# EAGLE design SparkFun GPS NEO_M9N (EAGLE 9.4.2)
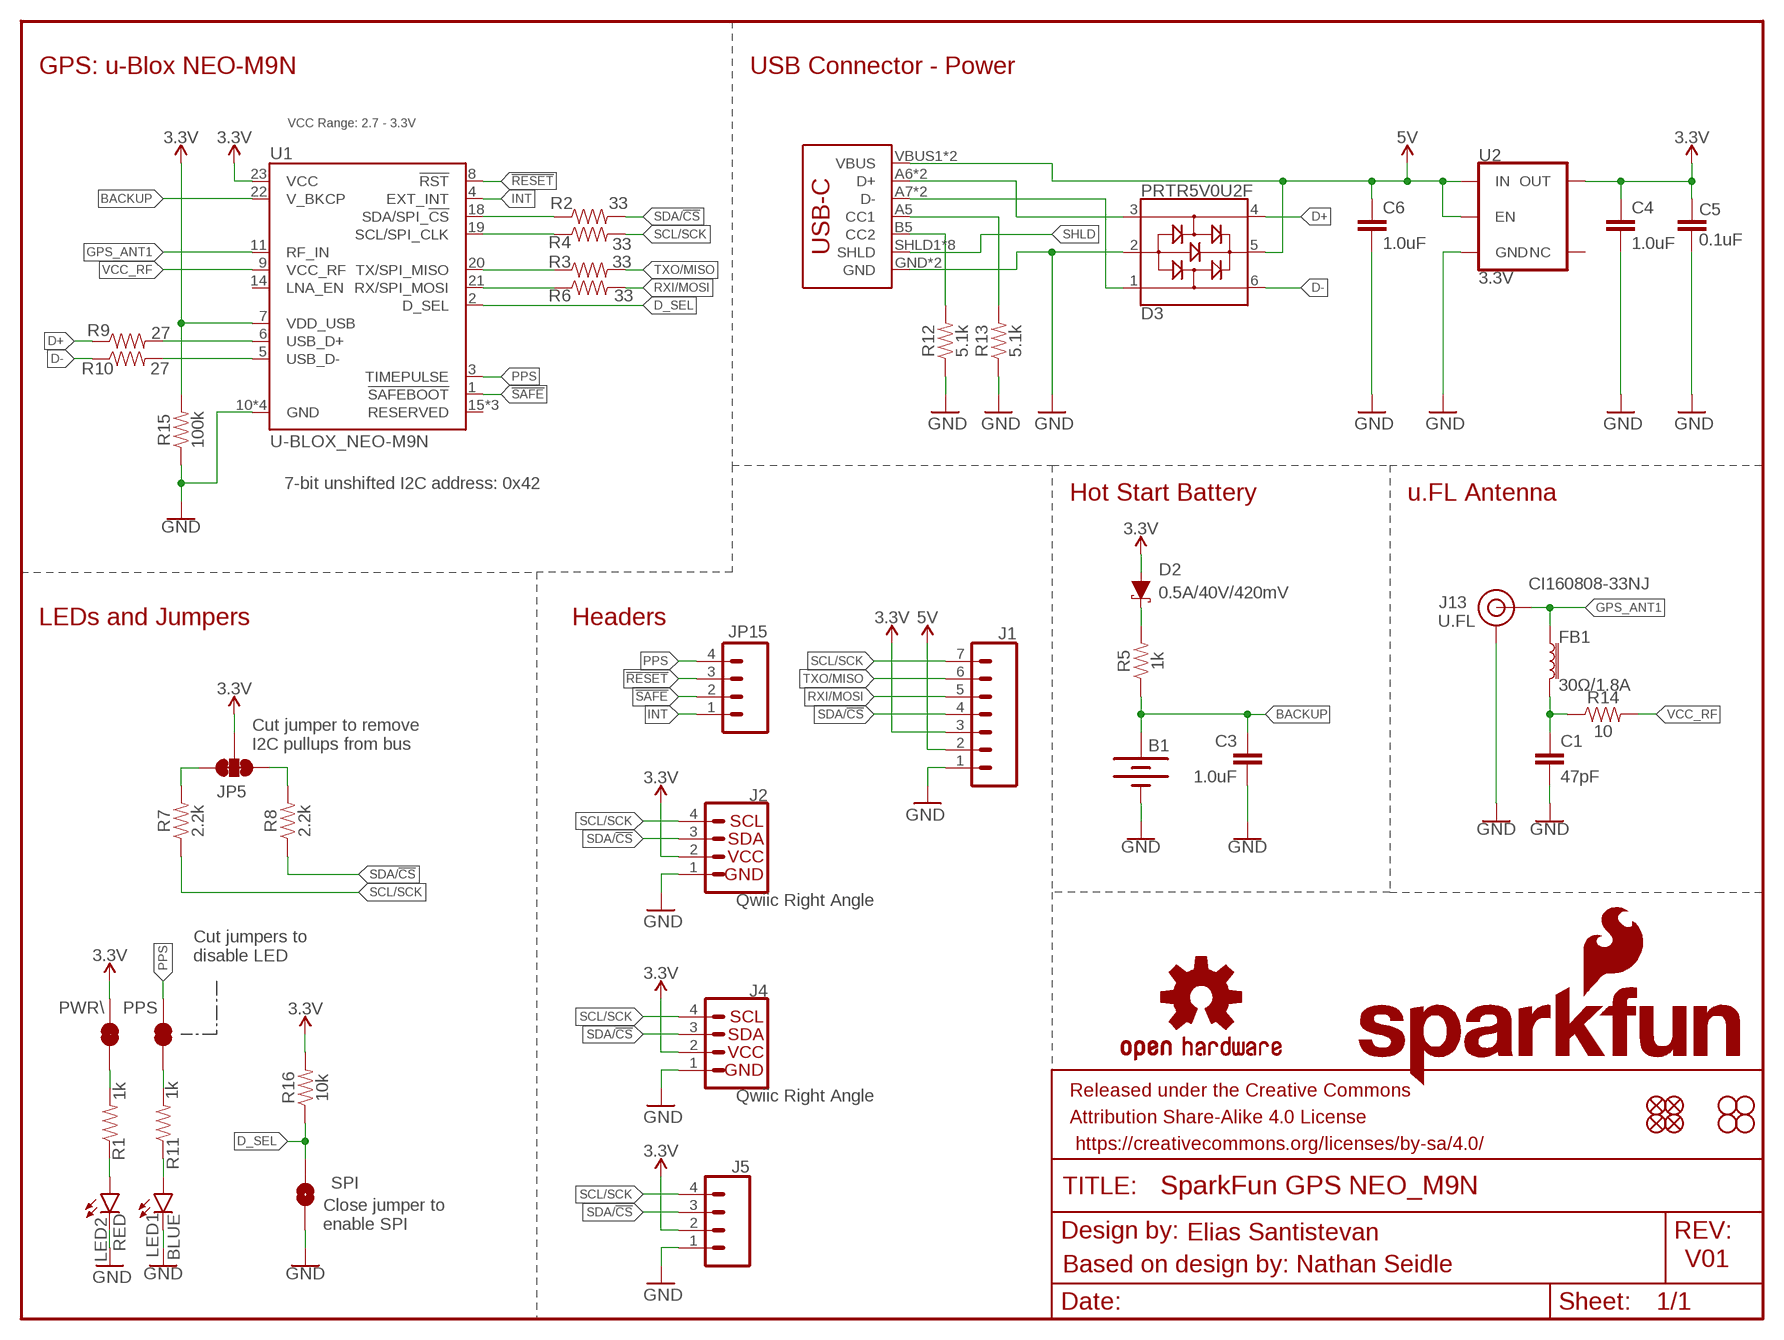
[diagram p0: schematic, sheet 1]

## Parts
B1  6.8MM_COIN_CELL  ML414H_IV01E_BATTERY  [ML414H_IV01E]
C1  47pF  47PF-0603-50V-5%  [0603]
C3  1.0uF  1.0UF-0603-16V-10%  [0603]
C4  1.0uF  1.0UF-0603-16V-10%  [0603]
C5  0.1uF  0.1UF-0603-25V-(+80/-20%)  [0603]
C6  1.0uF  1.0UF-0603-16V-10%  [0603]
D2  0.5A/40V/420mV  DIODE-SCHOTTKY-PMEG4005EJ  [SOD-323]
D3  PRTR5V0U2F  [SOT886]
FB1  30Ω/1.8A  FERRITE_BEAD-0603  [0603]
FRAME1  FRAME-LETTER  [CREATIVE_COMMONS]
J1  CONN_07NO_SILK  [1X07_NO_SILK]
J2  Qwiic Right Angle  I2C_STANDARDQWIIC  [JST04_1MM_RA]
J3  USB_C2-LAYER  [USB-C-16P]
J4  Qwiic Right Angle  I2C_STANDARDQWIIC  [JST04_1MM_RA]
J5  CONN_041X04_NO_SILK  [1X04_NO_SILK]
J13  U.FL  U.FL2PIN  [U.FL]
JP5  JUMPER-SMT_3_2-NC_TRACE_SILK  [SMT-JUMPER_3_2-NC_TRACE_SILK]
JP15  CONN_041X04_NO_SILK  [1X04_NO_SILK]
JP21  FIDUCIALUFIDUCIAL  [MICRO-FIDUCIAL]
JP31  STAND-OFF  [STAND-OFF]
JP41  STAND-OFF  [STAND-OFF]
JP61  FIDUCIALUFIDUCIAL  [MICRO-FIDUCIAL]
JP71  FIDUCIALUFIDUCIAL  [MICRO-FIDUCIAL]
JP81  FIDUCIALUFIDUCIAL  [MICRO-FIDUCIAL]
JP91  STAND-OFF  [STAND-OFF]
JP101  STAND-OFF  [STAND-OFF]
LED1  BLUE  LED-BLUE0603  [LED-0603]
LED2  RED  LED-RED0603  [LED-0603]
LOGO1  OSHW-LOGOMINI  [OSHW-LOGO-MINI]
LOGO2  SFE_LOGO_NAME_FLAME.1_INCH  [SFE_LOGO_NAME_FLAME_.1]
PPS  JUMPER-SMT_2_NC_TRACE_SILK  [SMT-JUMPER_2_NC_TRACE_SILK]
PWR\  JUMPER-SMT_2_NC_TRACE_SILK  [SMT-JUMPER_2_NC_TRACE_SILK]
R1  1k  1KOHM-0603-1/10W-1%  [0603]
R2  33  33OHM-0603-1/10W-1%  [0603]
R3  33  33OHM-0603-1/10W-1%  [0603]
R4  33  33OHM-0603-1/10W-1%  [0603]
R5  1k  1KOHM-0603-1/10W-1%  [0603]
R6  33  33OHM-0603-1/10W-1%  [0603]
R7  2.2k  2.2KOHM-0603-1/10W-1%  [0603]
R8  2.2k  2.2KOHM-0603-1/10W-1%  [0603]
R9  27  27OHM-0603-1/10W-1%  [0603]
R10  27  27OHM-0603-1/10W-1%  [0603]
R11  1k  1KOHM-0603-1/10W-1%  [0603]
R12  5.1k  5.1KOHM-0402-1/16W-1%  [0402]
R13  5.1k  5.1KOHM-0402-1/16W-1%  [0402]
R14  10  10OHM-0603-1/10W-1%  [0603]
R15  100k  100KOHM-0603-1/10W-1%  [0603]
R16  10k  10KOHM-0402-1/16W-1%  [0402]
SPI  JUMPER-SMT_2_NO_SILK  [SMT-JUMPER_2_NO_SILK]
U1  U-BLOX_NEO-M9N  [NEO-M9N]
U2  3.3V  V_REG_AP2112K-3.3V  [SOT23-5]

## Nets
3.3V [3.3V]: C4.1 C5.2 D2.A J1.3 J2.2 J4.2 J5.2 JP5.2 PWR\.2 R15.2 R16.2 U1.7(VDD_USB) U1.23(VCC) U2.5(OUT)
5V: C6.1 D3.5 J1.2 J3.VBUS1(VBUS) J3.VBUS2(VBUS) U2.1(IN) U2.3(EN)
!RESET: JP15.3 U1.8(!RST)
!SAFE: JP15.2 U1.1(!SAFEBOOT!)
ANT_VCC: C1.1 FB1.2 R14.1
BACKUP: B1.+ C3.1 R5.1 U1.22(V_BKCP)
D+: D3.4 R9.1
D-: D3.6 R10.1
D_SEL: R16.1 SPI.2 U1.2(D_SEL)
GND: B1.- C1.2 C3.2 C4.2 C5.1 C6.2 D3.2 J1.1 J2.1 J3.GND J3.GND2(GND) J4.1 J5.1 J13.1(GND) J13.2(GND) LED1.C LED2.C R12.1 R13.1 R15.1 SPI.1 U1.10(GND) U1.12(GND) U1.13(GND) U1.24(GND) U2.2(GND)
GPS_ANT1: FB1.1 J13.FEED(SIGNAL) U1.11(RF_IN)
INT: JP15.1 U1.4(EXT_INT)
N$1: PWR\.1 R1.2
N$2: LED1.A R11.1
N$4: PPS.1 R11.2
N$5: JP5.1 R8.2
N$6: D2.C R5.2
N$7: J3.B5(CC2) R12.2
N$8: JP5.3 R7.2
N$9: J3.A5(CC1) R13.2
N$10: LED2.A R1.1
N$11: R9.2 U1.6(USB_D+)
N$12: R10.2 U1.5(USB_D-)
PPS: JP15.4 PPS.2 U1.3(TIMEPULSE)
RXI/MOSI: J1.5 R6.2
RXLV: R6.1 U1.21(RX/SPI_MOSI)
SCL/SCK: J1.7 J2.4 J4.4 J5.4 R4.2 R7.1
SCL_LV: R4.1 U1.19(SCL/SPI_CLK)
SDA/!CS: J1.4 J2.3 J4.3 J5.3 R2.2 R8.1
SDA_LV: R2.1 U1.18(SDA/SPI_!CS!)
SHLD: J3.SHLD1(SHLD) J3.SHLD2(SHLD) J3.SHLD3(SHLD) J3.SHLD4(SHLD) J3.SHLD5(SHLD) J3.SHLD6(SHLD) J3.SHLD7(SHLD) J3.SHLD8(SHLD)
TXLV: R3.1 U1.20(TX/SPI_MISO)
TXO/MISO: J1.6 R3.2
USB_D+: D3.3 J3.A6(D+) J3.B6(D+)
USB_D-: D3.1 J3.A7(D-) J3.B7(D-)
VCC_RF: R14.2 U1.9(VCC_RF)
Unconnected: U1.14(LNA_EN) U1.15(RESERVED) U1.16(RESERVED) U1.17(RESERVED) U2.4(NC)

## Notes on the sheet
- GPS: u-Blox NEO-M9N | USB Connector - Power
- VCC Range: 2.7 - 3.3V
- 7-bit unshifted I2C address: 0x42
- Hot Start Battery | u.FL Antenna
- CI160808-33NJ
- LEDs and Jumpers | Headers
- Cut jumper to remove 
  I2C pullups from bus
- Cut jumpers to 
  disable LED
- Close jumper to
  enable SPI
- Elias Santistevan
- Based on design by: Nathan Seidle | V01

## Library data of the parts
B1 = SparkFun-Batteries:ML414H_IV01E_BATTERY: SEIKO ML414H-IV01E Reflowable Lithium Battery ML414H is a rechargeable, coin type battery with features such as Pb-free reflowable (Peak temperature: 260 C) and high temperature heat resistance. Battery Characteristics: 3.1V max voltage Voff is 2V 1mAH 3k series resistor with battery 72 hour charge time from 2.0-3.1V 2.3-2.8V initial charge; PROD_ID: BATT-14267
C1 = SparkFun-Capacitors:47PF: 47pF ceramic capacitors A capacitor is a passive two-terminal electrical component used to store electrical energy temporarily in an electric field.; PROD_ID: CAP-08913
C3 C4 C6 = SparkFun-Capacitors:1.0UF: 1µF ceramic capacitors A capacitor is a passive two-terminal electrical component used to store electrical energy temporarily in an electric field.; PROD_ID: CAP-00868
C5 = SparkFun-Capacitors:0.1UF: 0.1µF ceramic capacitors A capacitor is a passive two-terminal electrical component used to store electrical energy temporarily in an electric field.; PROD_ID: CAP-00810
D2 = SparkFun-DiscreteSemi:DIODE-SCHOTTKY: Schottky diode A Schottky diode is a semiconductor diode which has a low forward voltage drop and a very fast switching action.; PROD_ID: DIO-10955
D3 = SparkFun-IC-Power:PRTR5V0U2: A small ESD protection device. Most commonly used on USB D+/D- signals to protect large, expensive, or especially sensitive USB enabled devices.; PROD_ID: DIO-14084
FB1 = SparkFun-Coils:FERRITE_BEAD: Ferrite Bead (blocks, cores, rings, chokes, etc.) Inductor with layers of ferrite used to suppress high frequencies. Often used to isolate high frequency noise. SparkFun Products: IOIO-OTG - V2.2 <https://www.sparkfun.com/products/13613> SparkFun SAMD21 Mini Breakout <https://www.sparkfun.com/products/13664> SparkFun 6 Degrees of Freedom Breakout - LSM6DS3 <https://www.sparkfun.com/products/13339> SparkFun SAMD21 Dev Breakout <https://www.sparkfun.com/products/13672>; PROD_ID: NDUC-13805
FRAME1 = SparkFun-Aesthetics:FRAME-LETTER: Schematic Frame - Letter Standard 8.5x11 US Letter frame
J1 = SparkFun-Connectors:CONN_07: Multi connection point. Often used as Generic Header-pin footprint for 0.1 inch spaced/style header connections On any of the 0.1 inch spaced packages, you can populate with these: Break Away Headers - Straight <https://www.sparkfun.com/products/116> (PRT-00116) Break Away Male Headers - Right Angle <https://www.sparkfun.com/products/553> (PRT-00553) Female Headers <https://www.sparkfun.com/products/115> (PRT-00115) Break Away Headers - Machine Pin <https://www.sparkfun.com/products/117> (PRT-00117) Break Away Female Headers - Swiss Machine Pin <https://www.sparkfun.com/products/743> (PRT-00743) For SCREWTERMINALS and SPRING TERMINALS visit here: Screw Terimnals on SparkFun.com <https://www.sparkfun.com/search/results?term=Screw+Terminals> (5mm/3.5mm/2.54mm spacing) This device is also useful as a general connection point to wire up your design to another part of your project. Our various solder wires solder well into these plated through hole pads. Hook-Up Wire - Assortment (Stranded, 22 AWG) <https://www.sparkfun.com/products/11375> (PRT-11375) Hook-Up Wire - Assortment (Solid Core, 22 AWG) <https://www.sparkfun.com/products/11367> (PRT-11367) View the entire wire category on our website here <https://www.sparkfun.com/categories/141> Special notes: Molex polarized connector foot print use with SKU : PRT-08231 with associated crimp pins and housings. 1MM SMD Version SKU: PRT-10208 NOTES ON THE VARIANTS LOCK and LOCK_LONGPADS... This footprint was designed to help hold the alignment of a through-hole component (i.e. 6-pin header) while soldering it into place. You may notice that each hole has been shifted either up or down by 0.005 of an inch from it's more standard position (which is a perfectly straight line). This slight alteration caused the pins (the squares in the middle) to touch the edges of the holes. Because they are alternating, it causes a "brace" to hold the component in place. 0.005 has proven to be the perfect amount of "off-center" position when using our standard breakaway headers. Although looks a little odd when you look at the bare footprint, once you have a header in there, the alteration is very hard to notice. Also,if you push a header all the way into place, it is covered up entirely on the bottom side.
J2 J4 = SparkFun-Connectors:I2C_STANDARD: SparkFun I2C Standard Pinout Header SparkFun has standardized on a pinout for all I2C based sensor breakouts. This pinout allows I2C boards to be plugged directly into the headers on Arduino Uno compatible boards, and to be daisy chained easily. Example SparkFun Products: SparkFun Atmospheric Sensor Breakout - BME280 <https://www.sparkfun.com/products/13676> SparkFun Altitude/Pressure Sensor Breakout - MPL3115A2 <https://www.sparkfun.com/products/11084> SparkFun TOF Range Finder Sensor - VL6180 <https://www.sparkfun.com/products/12785>; PROD_ID: CONN-13694
J3 = SparkFun-Connectors:USB_C: USB Type C 16Pin Connector Super Speed pins not available on the 16-pin purely SMD connector so this part is best for USB 2.0 implementations. D1 and D2 are tied together enabling D+/- no matter which way the cable is plugged into the connector. The two channel configuration pins (CC1/2) are exposed. These are normally connected to ground via 5.1k resistors but can be reconfigured for high current/high power applications.; PROD_ID: CONN-14122
J5 JP15 = SparkFun-Connectors:CONN_04: Multi connection point. Often used as Generic Header-pin footprint for 0.1 inch spaced/style header connections On any of the 0.1 inch spaced packages, you can populate with these: Break Away Headers - Straight <https://www.sparkfun.com/products/116> (PRT-00116) Break Away Male Headers - Right Angle <https://www.sparkfun.com/products/553> (PRT-00553) Female Headers <https://www.sparkfun.com/products/115> (PRT-00115) Break Away Headers - Machine Pin <https://www.sparkfun.com/products/117> (PRT-00117) Break Away Female Headers - Swiss Machine Pin <https://www.sparkfun.com/products/743> (PRT-00743) For SCREWTERMINALS and SPRING TERMINALS visit here: Screw Terimnals on SparkFun.com <https://www.sparkfun.com/search/results?term=Screw+Terminals> (5mm/3.5mm/2.54mm spacing) This device is also useful as a general connection point to wire up your design to another part of your project. Our various solder wires solder well into these plated through hole pads. Hook-Up Wire - Assortment (Stranded, 22 AWG) <https://www.sparkfun.com/products/11375> (PRT-11375) Hook-Up Wire - Assortment (Solid Core, 22 AWG) <https://www.sparkfun.com/products/11367> (PRT-11367) View the entire wire category on our website here <https://www.sparkfun.com/categories/141> Special notes: Molex polarized connector foot print use with SKU : PRT-08231 with associated crimp pins and housings. 1MM SMD Version SKU: PRT-10208; PROD_ID: CONN-09696
J13 = SparkFun-Connectors:U.FL2PIN: SMD Antenna Connector - U.FL 2mm height, 3.0mm x 3.0mm receptacle size. SparkFun Products: SparkFun WiFi Shield - ESP8266 <https://www.sparkfun.com/products/13287> SparkFun ESP8266 Thing <https://www.sparkfun.com/products/13231> SparkFun MiniGen - Pro Mini Signal Generator Shield <https://www.sparkfun.com/products/11420>; PROD_ID: CONN-09193; SF_ID: WRL-09144
JP5 = SparkFun-Jumpers:JUMPER-SMT_3_2-NC_TRACE: Normally closed trace jumper (2 of 2 connections) This jumper has a trace between all three pads so they are normally closed (NC). Use a razor knife to open the connection(s). For best results follow the IPC guidelines for cutting traces: Cutout at least 0.063 mm (0.005 in). Remove all loose material to clean up the cut area. Seal the cut with an approved epoxy. Reapply solder to reclose the connection(s).
JP21 JP61 JP71 JP81 = SparkFun:FIDUCIAL: Fiducial Alignment Points Various fiducial points for machine vision alignment.
JP31 JP41 JP91 JP101 = SparkFun:STAND-OFF: Stand Off This is the mechanical footprint for a #4 phillips button head screw. Use the keepout ring to avoid running the screw head into surrounding components. SKU : PRT-00447
LED1 = SparkFun-LED:LED-BLUE: Blue SMD LED Used in manufacturing of various products at SparkFun Packages: 0603 - SMD 0603 package [Product Link] <http://www.digikey.com/product-detail/en/SMLE12BC7TT86/511-1589-2-ND/1641808> 1206 - SMD1206 package [Product Link] <http://www.digikey.com/product-detail/en/lite-on-inc/LTST-C150TBKT/160-1643-1-ND/573584> SparkFun Products: ESP8266 Thing-Dev Board <https://www.sparkfun.com/products/13711> RedBoard <https://www.sparkfun.com/products/12757>; PROD_ID: DIO-08575
LED2 = SparkFun-LED:LED-RED: Red SMD LED Used in manufacturing of most products at SparkFun Packages: 0603 - SMD 0603 package [Product Link] <http://docs.avagotech.com/docs/AV02-0551EN> 0603 SMART - SMD 0603 SMART package ( more efficient and expensive)[Product Link] <http://www.osram-os.com/Graphics/XPic2/00077099_0.pdf> 1206 - SMD1206 package [Product Link] <https://www.sparkfun.com/datasheets/DevTools/LilyPad/Q150OVS4.pdff> SparkFun Products: Pro Mini 328 -5V <https://www.sparkfun.com/products/821> RedBoard <https://www.sparkfun.com/products/12757> IOIO-OTG <https://www.sparkfun.com/products/13613>; PROD_ID: DIO-00819
LOGO1 = SparkFun-Aesthetics:OSHW-LOGO: Open-Source Hardware (OSHW) Logo This logo indicates the piece of hardware it is found on incorporates a OSHW license and/or adheres to the definition of open source hardware found here: http://freedomdefined.org/OSHW
LOGO2 = SparkFun-Aesthetics:SFE_LOGO_NAME_FLAME: SparkFun Font Logo w/ Flame This is the SparkFun full logo. The logo on the schematic will always be the same size; the package variant is the height of the flame part of the logo. Default layer for the logo on the board is tSilk.
PPS PWR\ = SparkFun-Jumpers:JUMPER-SMT_2_NC_TRACE: Normally closed trace jumper This jumper has a trace between two pads so it's normally closed (NC). Use a razor knife to open the connection. For best results follow the IPC guidelines for cutting traces: Cutout at least 0.063 mm (0.005 in). Remove all loose material to clean up the cut area. Seal the cut with an approved epoxy. Reapply solder to reclose the connection.
R1 R5 R11 = SparkFun-Resistors:1KOHM: 1kΩ resistor A resistor is a passive two-terminal electrical component that implements electrical resistance as a circuit element. Resistors act to reduce current flow, and, at the same time, act to lower voltage levels within circuits. - Wikipedia; PROD_ID: RES-07856
R2-R4 R6 = SparkFun-Resistors:33OHM: 33Ω resistor A resistor is a passive two-terminal electrical component that implements electrical resistance as a circuit element. Resistors act to reduce current flow, and, at the same time, act to lower voltage levels within circuits. - Wikipedia; PROD_ID: RES-08270
R7 R8 = SparkFun-Resistors:2.2KOHM: 2.2kΩ resistor A resistor is a passive two-terminal electrical component that implements electrical resistance as a circuit element. Resistors act to reduce current flow, and, at the same time, act to lower voltage levels within circuits. - Wikipedia; PROD_ID: RES-08272
R9 R10 = SparkFun-Resistors:27OHM: 27Ω resistor A resistor is a passive two-terminal electrical component that implements electrical resistance as a circuit element. Resistors act to reduce current flow, and, at the same time, act to lower voltage levels within circuits. - Wikipedia; PROD_ID: RES-09334
R12 R13 = SparkFun-Resistors:5.1KOHM; PROD_ID: RES-14340
R14 = SparkFun-Resistors:10OHM: 10Ω resistor A resistor is a passive two-terminal electrical component that implements electrical resistance as a circuit element. Resistors act to reduce current flow, and, at the same time, act to lower voltage levels within circuits. - Wikipedia; PROD_ID: RES-12581
R15 = SparkFun-Resistors:100KOHM: 100kΩ resistor A resistor is a passive two-terminal electrical component that implements electrical resistance as a circuit element. Resistors act to reduce current flow, and, at the same time, act to lower voltage levels within circuits. - Wikipedia; PROD_ID: RES-07828
R16 = SparkFun-Resistors:10KOHM: 10kΩ resistor A resistor is a passive two-terminal electrical component that implements electrical resistance as a circuit element. Resistors act to reduce current flow, and, at the same time, act to lower voltage levels within circuits. - Wikipedia; PROD_ID: RES-14241
SPI = SparkFun-Jumpers:JUMPER-SMT_2_NO: Normally open jumper This jumper has two pads in close proximity to each other. Apply solder to close the connection. Round pads are easier to solder for beginners, but are a lot larger. SparkFun Product that uses the round pads: SparkFun EL Sequencer <https://www.sparkfun.com/products/12781>
U1 = gps:U-BLOX_NEO-M9N; PROD_ID: IC-14651
U2 = SparkFun-IC-Power:V_REG_AP2112: AP2112 - 600mA CMOS LDO Regulator w/ Enable The AP2112 is CMOS process low dropout linear regulator with enable function, the regulator delivers a guaranteed 600mA (min.) continuous load current. Features Output Voltage Accuracy: ±1.5% Output Current: 600mA (Min.) Foldback Short Current Protection: 50mA Enable Function to Turn ON/OFF VOUT Low Dropout Voltage (3.3V): 250mV (Typ.) @IOUT=600mA Excellent Load Regulation: 0.2%/A (Typ.) Excellent Line Regulation: 0.02%/V (Typ.) Low Quiescent Current: 55μA (Typ.) Low Standby Current: 0.01μA (Typ.) Low Output Noise: 50μVRMS PSRR: 100Hz -65dB, 1kHz -65dB OTSD Protection Stable with 1.0μF Flexible Cap: Ceramic, Tantalum and Aluminum Electrolytic Operation Temperature Range: -40°C to 85°C ESD: MM 400V, HBM 4000V; PROD_ID: VREG-12457

## Net classes
1 vcc: width 0.152 mm
2 3.3V: width 0.508 mm

## Board
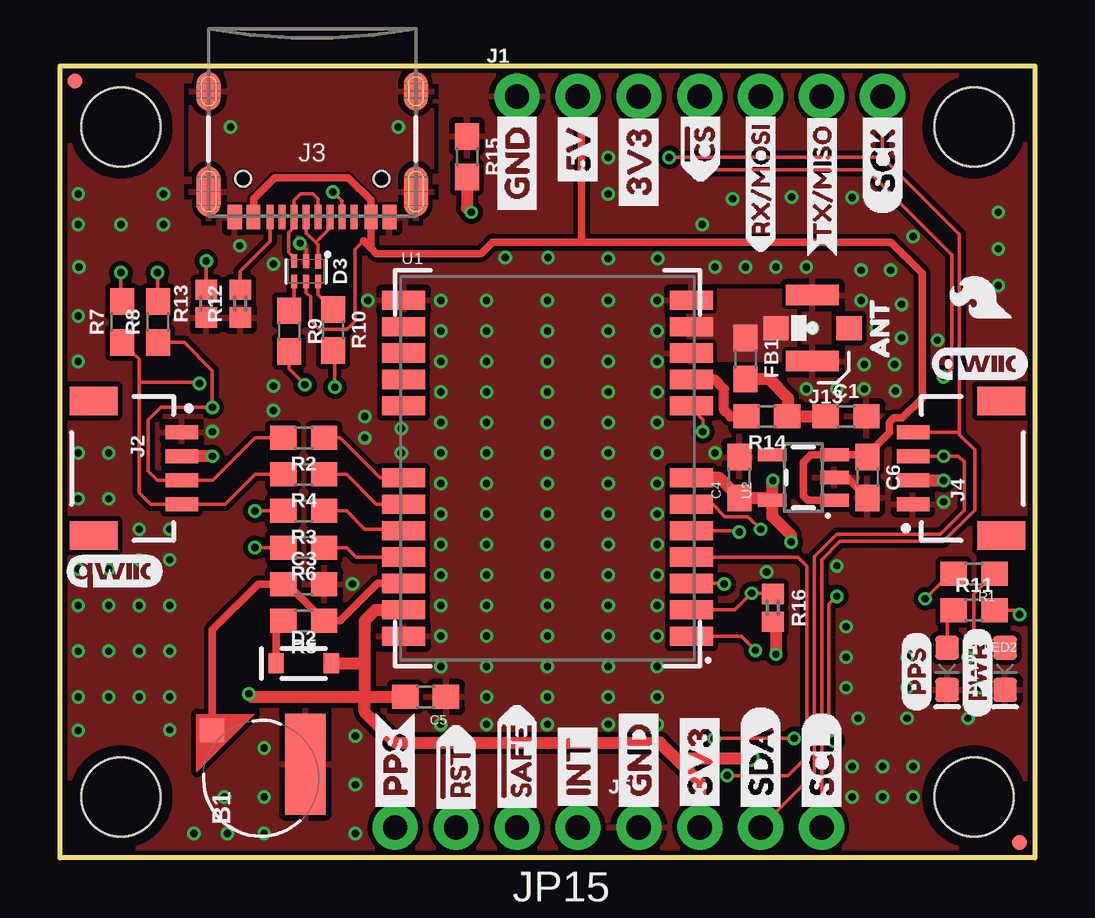
[diagram p1: board, top side]
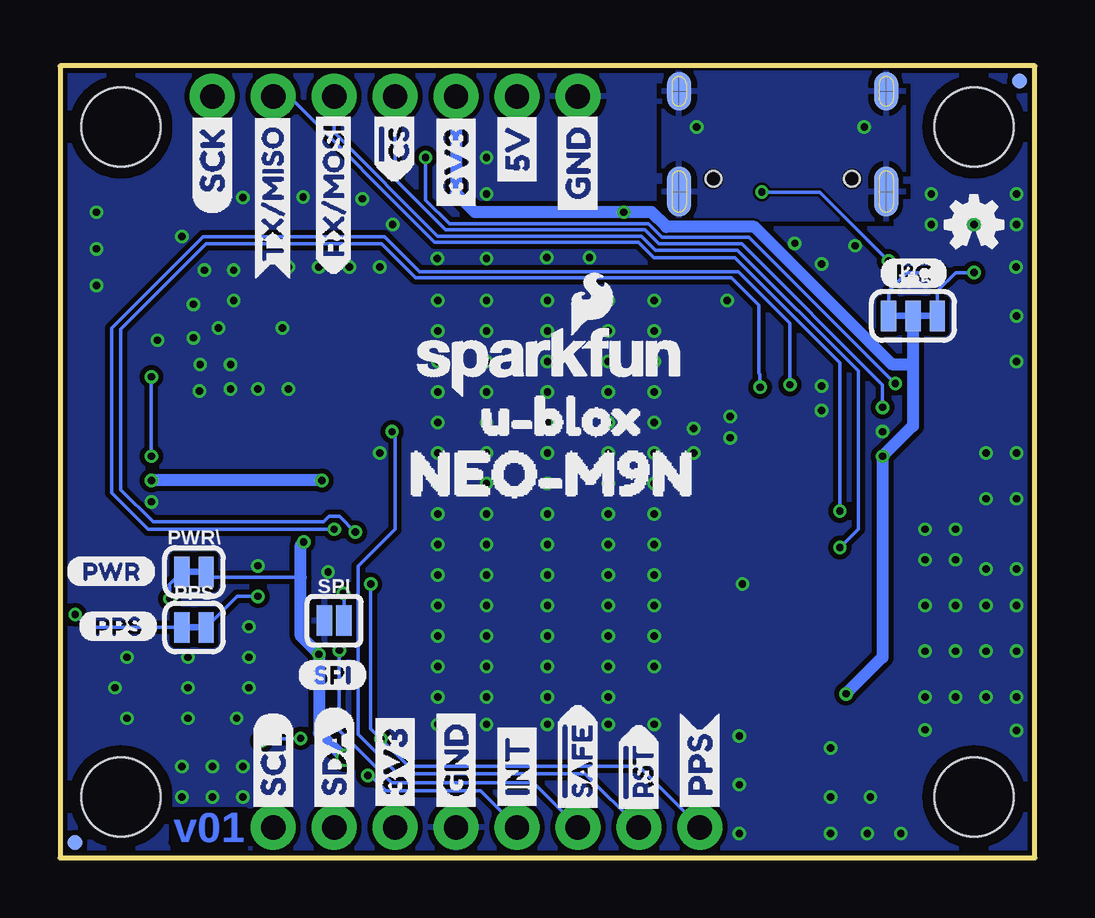
[diagram p2: board, bottom side, seen from below]

Size 40.64 x 32.99 mm. Coordinates in mm from the lower left corner, seen from the top.
Outline: 0,0 0,32.99 40.64,32.99 40.64,0 0,0
Copper layers (1*16): Top 0.035mm / dielectric 1.5mm / Bottom 0.035mm
Design rules "SparkFun-2-layer-FAB-LIMIT": minimum track width 4mil, minimum drill 6mil, track to track 4mil, track to pad 4mil, pad to pad 4mil, via to via 4mil, smd to smd 4mil, copper to edge 4mil, drill to drill 4mil, minimum pad ring 5mil, minimum via ring 5mil, stop-mask expansion 4mil, vias tented up to drill 25mil, thermal gap 10mil

### Footprints (pad centres in the part's own frame; a part is rotated, then mirrored left to right if it is on the bottom)
ML414H_IV01E = smd 1 x 1: + 2.022,2.032 | smd 4.2 x 1.7: - 0.6,-1.85
0603 = smd 1.1 x 1: 1 -0.85,0; 2 0.85,0
SOD-323 = smd 0.63 x 0.83: A 1.15,0; C -1.15,0
SOT886 = smd 0.61 x 0.25: 1 -0.405,0.5 | smd 0.56 x 0.25: 2 -0.43,0; 3 -0.43,-0.5; 4 0.43,-0.5; 5 0.43,0; 6 0.43,0.5
1X07_NO_SILK = drill 1.016 pad 1.88: 1 0,0; 2 2.54,0; 3 5.08,0; 4 7.62,0; 5 10.16,0; 6 12.7,0; 7 15.24,0
JST04_1MM_RA = smd 0.6 x 1.35: 1 -1.5,0; 2 -0.5,0; 3 0.5,0; 4 1.5,0 | smd 1.2 x 2: NC1 2.8,-3.675; NC2 -2.8,-3.675
USB-C-16P = smd 0.3 x 1.016: A5 -1.25,0.154; A6 -0.25,0.154; A7 0.25,0.154; A8 1.25,0.154; B5 1.75,0.154; B6 0.75,0.154; B7 -0.75,0.154; B8 -1.75,0.154 | smd 0.6 x 1.016: GND -3.225,0.154; GND2 3.225,0.154 | smd 1 x 2.1: SHLD1 -4.32,-0.915; SHLD2 4.32,-0.915 | smd 1 x 2.1 bottom: SHLD3 -4.32,-0.915; SHLD4 4.32,-0.915 | smd 1 x 1.6: SHLD5 -4.32,-5.095; SHLD8 4.32,-5.095 | smd 1 x 1.6 bottom: SHLD6 -4.32,-5.095; SHLD7 4.32,-5.095 | smd 0.55 x 1.016: VBUS1 -2.45,0.154; VBUS2 2.45,0.154 | hole 0.65: -2.89,-1.445; 2.89,-1.445
1X04_NO_SILK = drill 1.016 pad 1.88: 1 0,0; 2 2.54,0; 3 5.08,0; 4 7.62,0
U.FL = smd 2.2 x 0.85: 1 0,1.375; 2 0,-1.375 | smd 1.05 x 1: FEED 1.525,0; NC -1.525,0
SMT-JUMPER_3_2-NC_TRACE_SILK = smd 0.635 x 1.27: 1 -1.016,0; 2 0,0; 3 1.016,0
MICRO-FIDUCIAL = smd 0.635 x 0.635: 1 0,0
STAND-OFF = hole 3.302: 0,0
LED-0603 = smd 1 x 1: A -0.877,0; C 0.877,0
SMT-JUMPER_2_NC_TRACE_SILK = smd 0.635 x 1.27: 1 -0.508,0; 2 0.508,0
0402 = smd 0.85 x 0.9: 1 -0.58,0; 2 0.58,0
SMT-JUMPER_2_NO_SILK = smd 0.635 x 1.27: 1 -0.406,0; 2 0.406,0
NEO-M9N = smd 1.8 x 0.8: 1 6,-7; 2 6,-5.9; 3 6,-4.8; 4 6,-3.7; 5 6,-2.6; 6 6,-1.5; 7 6,-0.4; 8 6,2.6; 9 6,3.7; 10 6,4.8; 11 6,5.9; 12 6,7; 13 -6,7; 14 -6,5.9; 15 -6,4.8; 16 -6,3.7; 17 -6,2.6; 18 -6,-0.4; 19 -6,-1.5; 20 -6,-2.6; 21 -6,-3.7; 22 -6,-4.8; 23 -6,-5.9; 24 -6,-7
SOT23-5 = smd 0.55 x 1.2: 1 -0.95,-1.3; 2 0,-1.3; 3 0.95,-1.3; 4 0.95,1.3; 5 -0.95,1.3

### Placement (x,y rotation side)
B1  8.38,3.3 90 top
C1  32.77,18.39 0 top
C3  10.16,11.4 0 top
C4  28.32,15.85 90 top
C5  15.24,6.71 180 top
C6  33.66,15.85 270 top
D2  10.16,8.1 0 top
D3  10.26,24.43 270 top
FB1  28.57,20.8 270 top
FRAME1  -17.78,-17.78 0 top  (outside the outline)
J1  19.05,31.72 0 top
J2  5.08,16.23 270 top
J3  10.52,26.85 180 top
J4  35.56,16.23 90 top
J5  24.13,1.27 0 top
J13  31.37,22.07 180 top
JP5  5.08,22.58 0 bottom
JP15  21.59,1.27 180 top
JP21  40.01,0.64 0 top
JP31  2.54,30.45 0 top
JP41  38.1,30.45 0 top
JP61  0.64,32.36 0 top
JP71  40.01,0.64 0 bottom
JP81  0.64,32.36 0 bottom
JP91  2.54,2.54 0 top
JP101  38.1,2.54 0 top
LED1  36.98,7.87 270 top
LED2  39.4,7.87 270 top
LOGO1  2.54,26.39 0 bottom
LOGO2  20.19,20.68 0 bottom
PPS  35.05,9.6 0 bottom
PWR\  35.05,11.91 0 bottom
R1  38.1,11.84 180 top
R2  10.16,17.5 180 top
R3  10.16,14.45 180 top
R4  10.16,15.98 180 top
R5  10.16,9.88 180 top
R6  10.16,12.93 180 top
R7  2.59,22.33 90 top
R8  4.09,22.33 90 top
R9  9.55,21.95 270 top
R10  11.38,22 270 top
R11  38.1,10.31 0 top
R12  7.52,23.09 90 top
R13  6.1,23.09 90 top
R14  29.46,18.39 180 top
R15  16.97,29.21 270 top
R16  29.72,10.41 270 top
SPI  29.21,9.88 0 bottom
U1  20.32,16.23 0 top
U2  30.99,15.85 90 top
U$1  [SDA-[)]  29.21,1.65 90 top
U$2  [NEO#M9N1]  27.69,16 0 bottom
U$3  [SCL-[)]  31.75,1.65 90 top
U$4  [SDA-[)]  29.21,1.65 90 bottom
U$5  [SCL-[)]  31.75,1.65 90 bottom
U$6  [3V3-04]  26.67,1.65 90 top
U$7  [3V3-04]  26.67,1.65 90 bottom
U$8  [GND-04]  24.13,1.65 90 top
U$9  [GND-04]  24.13,1.65 90 bottom
U$10  [I_SUPER2_C-()-03]  6.48,24.36 0 bottom
U$11  [SPI1]  30.73,7.62 0 bottom
U$12  [PPS0]  39.88,9.65 0 bottom
U$13  [QWIIC_4MM]  38.35,20.57 0 top
U$14  [QWIIC_4MM]  2.29,11.94 0 top
U$15  [INT8]  21.59,1.65 90 top
U$16  [INT8]  21.59,1.65 90 bottom
U$17  [PWR1]  40.39,11.94 0 bottom
U$18  [PWR-()-03]  38.25,5.84 90 top
U$19  [5V]  21.59,27.66 90 top
U$20  [5V]  21.59,27.66 90 bottom
U$22  [U#BLOX3]  24.51,18.39 0 bottom
U$23  [CS#-<]]  26.7,27.91 90 top
U$24  [CS#-<]]  26.7,27.91 90 bottom
U$26  [RX#MOSI2]  29.21,25.17 90 top
U$31  [RX#MOSI3]  29.24,24.23 90 bottom
U$33  [SFE_LOGO_FLAME_.1]  38.35,23.34 90 top
U$34  [TX#MISO0]  31.78,24.99 90 top
U$35  [#RST3]  16.51,1.4 90 top
U$36  [#RST3]  16.51,1.4 90 bottom
U$37  [TX#MISO1]  31.78,24.03 90 bottom
U$38  [SCK-(]-04]  34.29,26.8 90 top
U$39  [#SAFE1]  19.05,1.4 90 top
U$40  [#SAFE1]  19.05,1.4 90 bottom
U$41  [SCK-(]-04]  34.29,26.8 90 bottom
U$43  [PPS5]  13.97,1.65 90 top
U$44  [PPS5]  13.97,1.65 90 bottom
U$52  [PPS0]  35.71,6.1 90 top
U$55  [ANT0]  34.16,20.17 90 top
U$60  [3V3-04]  24.13,26.64 90 bottom
U$61  [3V3-04]  24.13,26.64 90 top
U$62  [GND-04]  19.05,26.52 90 bottom
U$63  [GND-04]  19.05,26.52 90 top

### Tracks (layer width: path | path; a pad name or v marks a point on that pad's centre or on a via)
3.3V  (via drill 0.3, 0.51)
  Top 0.508: v6.35,16.73 J2.2 | U2.5 29.59,15 C4.1 27.49,15.83 U1.7 | U2.5 29.69,15.69 v29.72,15.72 | J4.2 v36.83,15.72 | v30.48,13.16 30.48,13.44 29.69,14.23 U2.5 | 25.96,3.86 25.02,4.8 13.97,4.8 12.7,6.07 12.7,6.71 | 25.96,3.86 26.67,3.15 J5.2 | 12.7,8.1 12.7,9.88 13.15,10.33 U1.23 | v7.87,6.83 8,6.71 12.7,6.71 | D2.A 12.7,8.1 | R15.2 16.97,27.08 v17.14,26.9 | 25.96,3.86 26.24,4.14 28.75,4.14 v28.78,4.17 | 12.7,6.71 C5.2 | 12.7,8.1 12.7,6.71 | R16.2 29.84,9.71 v29.84,8.48
  Bottom 0.152: PWR\.2 34.31,11.68 30.61,11.68
  Bottom 0.508: v29.72,15.72 v36.83,15.72 | v7.87,6.83 6.35,8.36 v6.35,16.73 5.08,18 5.08,20.57 | J1.3 24.13,27.69 23.34,26.9 v17.14,26.9 15.98,26.9 15.37,26.29 11.69,26.29 10.86,25.46 5.97,20.57 5.08,20.57 | v30.48,13.16 30.61,13.03 30.61,11.68 30.61,9.25 v29.84,8.48 29.84,5.21 28.8,4.17 v28.78,4.17 | JP5.2 5.08,20.57
5V
  Top 0.152: D3.5 10.26,23.55 10.44,23.37 10.44,22.38 10.79,22.02 11.96,22.02 12.29,22.35 12.29,25.35 12.65,25.71
  Top 0.254: 33.62,16.74 C6.1
  Top 0.305: 33.62,16.74 33.66,16.78 33.63,16.8 U2.3 31.3,16.8 30.99,16.48 30.99,15.09 31.18,14.9 U2.1 | 21.74,25.65 34.65,25.65 35.94,24.36 35.94,19.15 35.12,18.34 34.76,18.34 34.58,18.16 34.58,17.71 33.66,16.79 C6.1 | J3.VBUS2 8.07,27.47 8.94,28.35 12.01,28.35 12.97,27.39 J3.VBUS1 12.97,25.39 | J1.2 21.74,31.57 21.74,25.65 | 12.65,25.71 12.97,25.39 | 12.97,25.39 13.18,25.17 17.55,25.17 18.03,25.65 21.74,25.65
!RESET  (via drill 0.3)
  Top 0.152: v26.8,17.75 26.8,18.26 26.32,18.74 U1.8
  Bottom 0.152: JP15.3 18.75,3.5 26.57,3.5 28.22,5.16 28.22,12.14 26.67,13.69 26.67,17.63 v26.8,17.75
!SAFE  (via drill 0.3)
  Top 0.152: v28.99,8.64 28.41,9.23 U1.1
  Bottom 0.152: JP15.2 20.9,3.12 26.82,3.12 29.01,5.31 29.01,8.63 v28.99,8.64
ANT_VCC
  Top 0.305: R14.1 30.48,18.39 30.35,18.52
  Top 0.508: 30.48,18.39 C1.1 | FB1.2 29.55,19.95 30.35,19.15 30.35,18.52
BACKUP
  Top 0.152: 9.49,11.4 C3.1
  Top 0.305: 9.49,11.4 R5.1 11.68,9.88 13.23,11.43 U1.22 | C3.1 8.26,11.4 6.35,9.5 B1.+
D+
  Top 0.152: R9.1 9.76,23.01 D3.4
D-
  Top 0.152: R10.1 10.76,23.46 D3.6
D_SEL  (via drill 0.3)
  Top 0.152: U1.2 28.14,10.33 v28.83,11.02 29.69,11.02
  Top 0.254: 29.69,11.02 R16.1
  Bottom 0.152: SPI.2 28.8,11 v28.83,11.02
GND  (via drill 0.3)
  Top 0.152: D3.2 10.26,25.35 v10.01,25.6
  Top 0.305: U2.2 32.8,15.85 C6.2
  other vias: 6.35,17.75 32.77,9.63 32.38,12.17 33.27,5.82 33.02,3.81 15.88,9.25 17.78,9.25 8.51,2.54 12.19,11.4 12.83,23.22 36.83,14.83 20.32,9.25 22.86,9.25 24.89,9.25 15.88,10.52 17.78,10.52 20.32,10.52 22.86,10.52 24.89,10.52 15.88,11.79 17.78,11.79 20.32,11.79 22.86,11.79 24.89,11.79 15.88,13.06 17.78,13.06 20.32,13.06 22.86,13.06 24.89,13.06 15.88,14.33 17.78,14.33 20.32,14.33 22.86,14.33 24.89,14.33 15.88,15.6 17.78,15.6 20.32,15.6 22.86,15.6 24.89,15.6 15.88,16.87 17.78,16.87 20.32,16.87 22.86,16.87 24.89,16.87 15.88,18.14 17.78,18.14 20.32,18.14 22.86,18.14 24.89,18.14 15.88,19.41 17.78,19.41 20.32,19.41 22.86,19.41 24.89,19.41 15.88,20.68 17.78,20.68 20.32,20.68 22.86,20.68 24.89,20.68 15.88,21.95 17.78,21.95 20.32,21.95 22.86,21.95 24.89,21.95 15.88,23.22 17.78,23.22 20.32,23.22 22.86,23.22 24.89,23.22 31.11,19.53 33.53,20.55 33.4,23.22 36.58,21.56 33.02,27.51 35.56,25.88 22.86,27.66 22.86,29.18 31.37,22.07 27.3,16.87 33.02,2.54 35.56,2.54 35.56,3.81 37.85,8.36 6.86,2.54 5.59,1.02 0.79,24.61 0.76,26.39 0.76,27.66 0.76,14.96 0.76,16.87 0.76,20.68 0.76,22.58 0.76,5.31 0.76,6.71 0.76,8.61 0.76,10.52 0.76,12.04 2.03,6.71 2.03,8.61 2.03,10.52 2.03,12.04 3.3,6.71 3.3,8.61 3.3,10.52 3.3,12.42 4.57,5.33 4.57,6.71 4.57,8.61 4.57,10.52 4.57,12.42 15.88,7.98 17.78,7.98 20.32,7.98 22.86,7.98 24.89,7.98 17.78,6.71 20.32,6.71 22.86,6.71 24.89,6.71 15.88,5.56 17.78,5.56 20.32,5.56 22.86,5.56 24.89,5.56 2.54,26.39 4.32,26.39 4.32,27.66 7.49,25.5 14.22,16.87 14.22,17.88 12.7,17.5 12.7,18.39 34.29,2.54 34.29,3.81 32.77,8.36 35.31,8.36 3.3,13.69 4.57,13.69 2.03,14.96 2.03,16.87 32.38,19.53 33.53,19.53 34.04,22.07 33.4,24.49 34.8,20.55 29.84,24.61 31.11,24.61 28.57,24.61 27.3,24.61 6.99,1.02 12.32,3.05 12.32,5.08 8.51,4.57 38.35,7.09 35.31,7.09 32.77,7.09 37.85,5.82 35.31,5.82 8.51,1.02 12.32,1.02 29.46,11.91 39.12,26.9 39.12,25.37 39.12,23.85 8.89,19.66 8.89,18.64 22.86,24.97 18.57,25.02 20.35,25.02 24.92,24.97 26.77,26.39 28.04,27.46 35.08,21.67 35.08,23.06 34.62,24.49 34.82,19.46 30.51,27.53 8.89,24.74
  pour Top (isolate 0.203, rank 4): 0,32.99 40.64,32.99 40.64,0 0,0
  pour Bottom (isolate 0.203, rank 4): 0,32.99 40.64,32.99 40.64,0 0,0
GPS_ANT1
  pour Top (isolate 0.152, no thermals): 26.34,23.47 26.34,20.92 30.48,20.92 30.48,23.47
INT  (via drill 0.3)
  Top 0.152: v27.81,3.43 30.35,3.43 31.14,4.22 31.14,12.14 30.75,12.53 U1.4
  Bottom 0.152: JP15.1 23.11,2.79 27.05,2.79 27.69,3.43 v27.81,3.43
N$1  (via drill 0.3)
  Top 0.152: v36.07,10.79 37.11,11.84 R1.2
  Bottom 0.152: PWR\.1 36.07,11.4 v36.07,10.79
N$2
  Top 0.152: 36.78,8.75 LED1.A 36.98,10.04 R11.1
N$4  (via drill 0.3)
  Top 0.152: R11.2 39.83,10.31 v40.01,10.13
  Bottom 0.152: v40.01,10.13 39.47,9.6 PPS.1
N$5  (via drill 0.3)
  Top 0.152: R8.2 4.06,23.2 v4.06,24.38
  Bottom 0.152: v4.06,24.38 5.33,24.38 6.1,23.62 JP5.1
N$6
  Top 0.152: 9.01,9.58 R5.2
  Top 0.305: D2.C 9.01,9.58
N$7
  Top 0.152: J3.B5 8.77,25.69 7.52,24.44 R12.2
N$8  (via drill 0.3)
  Top 0.152: R7.2 2.54,23.23 v2.54,24.38
  Bottom 0.152: v2.54,24.38 3.3,24.38 4.06,23.62 JP5.3
N$9  (via drill 0.3)
  Top 0.152: J3.A5 11.77,27.35 v11.38,27.74 | v6.1,24.87 R13.2
  Bottom 0.152: v11.38,27.74 8.97,27.74 v6.1,24.87
N$10
  Top 0.152: R1.1 38.1,10.99 38.1,9.53 38.87,8.75 LED2.A
N$11  (via drill 0.3)
  Top 0.152: R9.2 9.55,20.37 v10.21,19.71 | v29.21,13.69 28.68,14.22 27.73,14.22 27.22,14.73 U1.6
  Bottom 0.152: v29.21,13.69 36.96,13.69 38.48,15.21 38.48,22.07 34.67,25.88 27.1,25.88 25.64,24.42 12.36,24.42 10.21,22.28 v10.21,19.71
N$12  (via drill 0.3)
  Top 0.152: R10.2 11.46,21.07 v11.46,19.61 | v28.32,13.57 28.26,13.63 U1.5
  Bottom 0.152: v11.46,19.61 11.46,20.14 11.51,20.19 11.51,23.01 12.66,24.17 25.82,24.17 27.23,25.58 34.55,25.58 38.1,22.02 38.1,15.34 36.75,13.99 29.66,13.99 29.43,14.22 28.99,14.22 28.34,13.57 v28.32,13.57
PPS  (via drill 0.3)
  Top 0.152: v32.38,10.9 32.05,10.57 32.05,5.05 v32.24,4.87 | v30.61,4.98 27.29,4.98 v27.27,4.96 | U1.3 27.66,11.43 v27.69,11.4
  Bottom 0.152: JP15.4 16.51,3.81 26.12,3.81 v27.27,4.96 27.69,5.38 v27.69,11.4 | v32.38,10.9 33.25,10.9 PPS.2 | v32.24,4.87 32.14,4.97 v30.61,4.97 v30.61,4.98
RXI/MOSI  (via drill 0.3)
  Top 0.152: R6.2 v8.13,12.93
  Bottom 0.152: v8.13,12.93 7.37,13.69 7.37,20.3 12.39,25.32 15.82,25.32 16.41,25.91 24.89,25.91 29.21,30.23 J1.5
RXLV
  Top 0.152: R6.1 11.94,12.93 12.34,12.53 U1.21
SCL/SCK  (via drill 0.3)
  Top 0.152: R4.2 8.13,15.98 6.88,14.73 J2.4 3.79,14.73 3.3,15.21 3.3,19.81 | 37.49,17.75 37.49,25.98 34.29,29.18 | 37.49,17.75 37.49,17.63 38.13,16.99 38.13,14.48 36.83,13.18 32.51,13.18 31.75,12.42 J5.4 | v25.4,29.18 34.29,29.18 | 37.49,17.75 37.47,17.73 J4.4 | J1.7 34.29,29.18 | R7.1 3.3,20.77 3.3,19.81 | 3.3,19.81 5.77,19.81 v5.82,19.76
  Bottom 0.152: v5.82,19.76 11.91,25.86 15.55,25.86 16.11,26.42 24.41,26.42 25.4,27.41 v25.4,29.18
SCL_LV
  Top 0.152: R4.1 11.94,15.98 13.18,14.73 U1.19
SDA/!CS  (via drill 0.3)
  Top 0.152: R2.2 8.13,17.5 6.36,15.73 J2.3 4.06,15.73 3.68,16.1 3.68,18.26 4.19,18.77 v6.35,18.77 6.35,20.3 5.17,21.48 R8.1 | J4.3 v36.83,16.73 37.46,16.73 37.69,16.49 37.69,14.48 36.7,13.49 32.39,13.49 31.45,12.55 31.45,3.5 J5.3 | v26.67,28.68 33.63,28.68 37.19,25.12 37.19,20.4 v36.83,20.04
  Bottom 0.152: v6.35,18.77 6.35,19.71 12.22,25.58 12.7,25.58 15.67,25.58 16.26,26.16 24.56,26.16 26.67,28.27 v26.67,28.68 J1.4 | v36.83,16.73 v36.83,20.04
SDA_LV
  Top 0.152: R2.1 11.68,17.5 13.35,15.83 U1.18
SHLD  (via drill 0.3)
  other vias: 14.1,30.45 7.11,30.45
  pour Bottom: 15.49,32.99 15.49,26.62 5.46,26.62 5.46,32.99
  pour Top: 15.49,32.99 15.49,26.62 5.46,26.62 5.46,32.99
TXLV
  Top 0.152: R3.1 11.94,14.45 12.7,13.69 14.26,13.69 U1.20
TXO/MISO  (via drill 0.3)
  Top 0.152: R3.2 v8.13,14.45
  Bottom 0.152: v8.13,14.45 8.13,20.63 12.51,25.01 15.89,25.01 16.54,25.65 25.02,25.65 31.09,31.73 J1.6
USB_D+
  Top 0.152: J3.A6 10.77,27.44 10.54,27.66 10.03,27.66 9.77,27.39 J3.B6 9.77,26.28 9.53,26.04 9.53,25.23 9.76,24.99 D3.3
USB_D-
  Top 0.152: J3.A7 10.27,26.03 10.65,25.64 | J3.B7 11.27,26.25 10.65,25.64 | D3.1 10.76,25.54 10.65,25.64
VCC_RF
  Top 0.406: U1.9 27.29,19.93 27.69,19.53 27.69,18.64 27.94,18.39 R14.2

### Text on the board
Bottom: v01
Measures: Measurements in inches
tDocu: Elias Santistevan